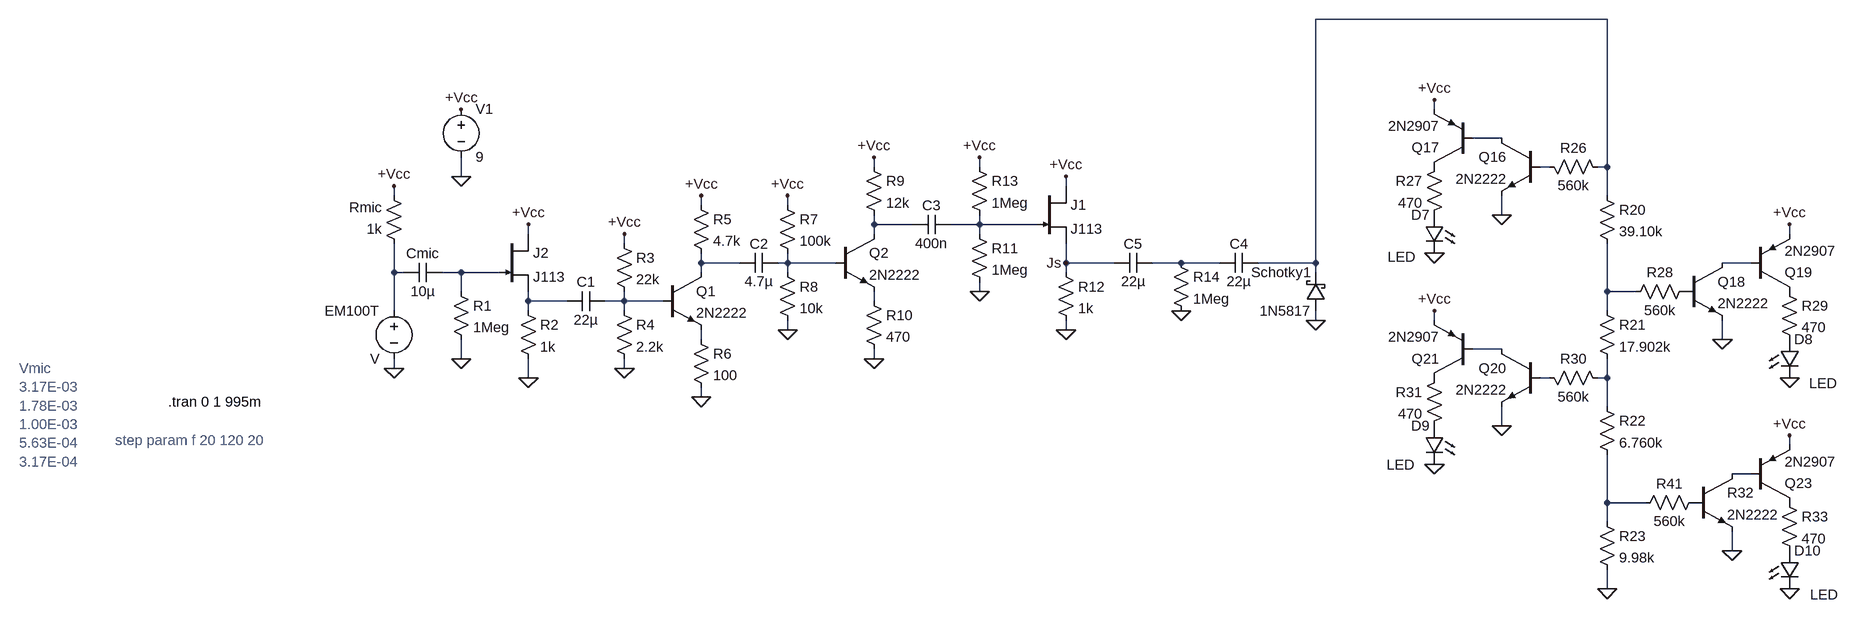
[diagram p0: schematic sound_level_meter_SPICE.asc]
sound_level_meter_SPICE.asc, the LTspice schematic file:
Version 4.1
SHEET 1 3044 2084
WIRE 1920 736 1424 736
WIRE 1632 928 1632 912
WIRE 1744 976 1696 976
WIRE 688 1024 688 1008
WIRE 864 1024 864 1008
WIRE 1824 1024 1808 1024
WIRE 1920 1024 1920 736
WIRE 1920 1024 1904 1024
WIRE 0 1040 0 1008
WIRE 1008 1056 1008 1040
WIRE -112 1072 -112 1056
WIRE 1920 1072 1920 1024
WIRE 400 1088 400 1072
WIRE 544 1088 544 1072
WIRE 1744 1104 1744 1072
WIRE 688 1120 688 1104
WIRE 752 1120 688 1120
WIRE 864 1120 864 1104
WIRE 864 1120 816 1120
WIRE 960 1120 864 1120
WIRE 112 1136 112 1120
WIRE 688 1136 688 1120
WIRE 864 1136 864 1120
WIRE 2224 1136 2224 1120
WIRE 272 1152 272 1136
WIRE 400 1184 400 1168
WIRE 464 1184 400 1184
WIRE 544 1184 544 1168
WIRE 544 1184 528 1184
WIRE 624 1184 544 1184
WIRE 1008 1184 1008 1152
WIRE 1088 1184 1008 1184
WIRE 1200 1184 1152 1184
WIRE 1264 1184 1200 1184
WIRE 1424 1184 1424 736
WIRE 1424 1184 1328 1184
WIRE 2160 1184 2112 1184
WIRE -112 1200 -112 1152
WIRE -96 1200 -112 1200
WIRE 0 1200 -32 1200
WIRE 64 1200 0 1200
WIRE 400 1200 400 1184
WIRE 544 1200 544 1184
WIRE 1008 1200 1008 1184
WIRE 1424 1200 1424 1184
WIRE 0 1232 0 1200
WIRE 864 1232 864 1216
WIRE 1920 1232 1920 1152
WIRE 1968 1232 1920 1232
WIRE 112 1248 112 1232
WIRE 176 1248 112 1248
WIRE 272 1248 272 1232
WIRE 272 1248 240 1248
WIRE 336 1248 272 1248
WIRE 688 1248 688 1232
WIRE -112 1264 -112 1200
WIRE 112 1264 112 1248
WIRE 272 1264 272 1248
WIRE 1920 1264 1920 1232
WIRE 1424 1280 1424 1264
WIRE 1632 1280 1632 1264
WIRE 544 1296 544 1280
WIRE 1008 1296 1008 1280
WIRE 400 1312 400 1296
WIRE 2112 1312 2112 1280
WIRE 1744 1328 1696 1328
WIRE 0 1344 0 1312
WIRE 688 1344 688 1328
WIRE -112 1360 -112 1344
WIRE 272 1360 272 1344
WIRE 112 1376 112 1344
WIRE 1824 1376 1808 1376
WIRE 1920 1376 1920 1344
WIRE 1920 1376 1904 1376
WIRE 400 1408 400 1392
WIRE 1920 1424 1920 1376
WIRE 1744 1456 1744 1424
WIRE 2224 1488 2224 1472
WIRE 2160 1536 2128 1536
WIRE 1920 1584 1920 1504
WIRE 1984 1584 1920 1584
WIRE 1920 1616 1920 1584
WIRE 2128 1664 2128 1632
WIRE 1920 1728 1920 1696
FLAG 0 928 +Vcc
FLAG 0 1040 0
FLAG 1920 1728 0
FLAG 1744 1104 0
FLAG 1632 912 +Vcc
FLAG 1632 1168 0
FLAG 2112 1312 0
FLAG 2224 1120 +Vcc
FLAG 2224 1376 0
FLAG 1744 1456 0
FLAG 1632 1264 +Vcc
FLAG 1632 1520 0
FLAG 2128 1664 0
FLAG 2224 1472 +Vcc
FLAG 2224 1728 0
FLAG 112 1376 0
FLAG 0 1344 0
FLAG 112 1120 +Vcc
FLAG -112 1360 0
FLAG -112 1056 +Vcc
FLAG 1424 1280 0
FLAG 272 1136 +Vcc
FLAG 400 1072 +Vcc
FLAG 272 1360 0
FLAG 400 1408 0
FLAG 544 1072 +Vcc
FLAG 688 1008 +Vcc
FLAG 544 1296 0
FLAG 688 1344 0
FLAG 1008 1040 +Vcc
FLAG 864 1232 0
FLAG 1008 1296 0
FLAG 864 1008 +Vcc
FLAG 1008 1184 Js
FLAG 1200 1264 0
SYMBOL voltage 0 912 R0
SYMATTR InstName V1
SYMATTR Value 9
SYMBOL res 1904 1056 R0
SYMATTR InstName R20
SYMATTR Value 39.10k
SYMBOL res 1904 1248 R0
SYMATTR InstName R21
SYMATTR Value 17.902k
SYMBOL res 1904 1408 R0
SYMATTR InstName R22
SYMATTR Value 6.760k
SYMBOL res 1904 1600 R0
SYMATTR InstName R23
SYMATTR Value 9.98k
SYMBOL res 1808 1008 M90
WINDOW 0 0 56 VBottom 2
WINDOW 3 32 56 VTop 2
SYMATTR InstName R26
SYMATTR Value 560k
SYMBOL npn 1808 976 M0
SYMATTR InstName Q16
SYMATTR Value 2N2222
SYMBOL pnp 1696 1024 R180
SYMATTR InstName Q17
SYMATTR Value 2N2907
SYMBOL res 1648 1008 M0
SYMATTR InstName R27
SYMATTR Value 470
SYMBOL LED 1648 1104 M0
WINDOW 3 47 70 Left 2
SYMATTR Value LED
SYMATTR InstName D7
SYMBOL res 2064 1216 R90
WINDOW 0 0 56 VBottom 2
WINDOW 3 32 56 VTop 2
SYMATTR InstName R28
SYMATTR Value 560k
SYMBOL npn 2048 1184 R0
SYMATTR InstName Q18
SYMATTR Value 2N2222
SYMBOL pnp 2160 1232 M180
SYMATTR InstName Q19
SYMATTR Value 2N2907
SYMBOL res 2208 1216 R0
SYMATTR InstName R29
SYMATTR Value 470
SYMBOL LED 2208 1312 R0
WINDOW 3 49 73 Left 2
SYMATTR Value LED
SYMATTR InstName D8
SYMBOL res 1808 1360 M90
WINDOW 0 0 56 VBottom 2
WINDOW 3 32 56 VTop 2
SYMATTR InstName R30
SYMATTR Value 560k
SYMBOL npn 1808 1328 M0
SYMATTR InstName Q20
SYMATTR Value 2N2222
SYMBOL pnp 1696 1376 R180
SYMATTR InstName Q21
SYMATTR Value 2N2907
SYMBOL res 1648 1360 M0
SYMATTR InstName R31
SYMATTR Value 470
SYMBOL LED 1648 1456 M0
WINDOW 3 49 65 Left 2
SYMATTR Value LED
SYMATTR InstName D9
SYMBOL res 2080 1568 R90
WINDOW 0 0 56 VBottom 2
WINDOW 3 32 56 VTop 2
SYMATTR InstName R41
SYMATTR Value 560k
SYMBOL npn 2064 1536 R0
SYMATTR InstName R32
SYMATTR Value 2N2222
SYMBOL pnp 2160 1584 M180
SYMATTR InstName Q23
SYMATTR Value 2N2907
SYMBOL res 2208 1568 R0
SYMATTR InstName R33
SYMATTR Value 470
SYMBOL LED 2208 1664 R0
WINDOW 3 50 74 Left 2
SYMATTR Value LED
SYMATTR InstName D10
SYMBOL njf 64 1136 R0
SYMATTR InstName J2
SYMATTR Value J113
SYMBOL res 96 1248 R0
SYMATTR InstName R2
SYMATTR Value 1k
SYMBOL res -16 1216 R0
SYMATTR InstName R1
SYMATTR Value 1Meg
SYMBOL voltage -112 1248 M0
WINDOW 123 0 0 Left 0
WINDOW 39 0 0 Left 0
SYMATTR InstName EM100T
SYMBOL res -96 1168 R180
WINDOW 0 36 76 Left 2
WINDOW 3 36 40 Left 2
SYMATTR InstName Rmic
SYMATTR Value 1k
SYMBOL cap -32 1184 R90
WINDOW 0 0 32 VBottom 2
WINDOW 3 32 32 VTop 2
SYMATTR InstName Cmic
SYMATTR Value 10µ
SYMBOL schottky 1440 1264 R180
WINDOW 0 24 64 Left 2
WINDOW 3 24 0 Left 2
SYMATTR InstName Schotky1
SYMATTR Value 1N5817
SYMBOL cap 240 1232 R90
WINDOW 0 0 32 VBottom 2
WINDOW 3 32 32 VTop 2
SYMATTR InstName C1
SYMATTR Value 22µ
SYMBOL res 256 1136 R0
SYMATTR InstName R3
SYMATTR Value 22k
SYMBOL res 256 1248 R0
SYMATTR InstName R4
SYMATTR Value 2.2k
SYMBOL res 384 1072 R0
SYMATTR InstName R5
SYMATTR Value 4.7k
SYMBOL res 384 1296 R0
SYMATTR InstName R6
SYMATTR Value 100
SYMBOL npn 336 1200 R0
SYMATTR InstName Q1
SYMATTR Value 2N2222
SYMBOL cap 528 1168 R90
WINDOW 0 0 32 VBottom 2
WINDOW 3 32 32 VTop 2
SYMATTR InstName C2
SYMATTR Value 4.7µ
SYMBOL res 528 1072 R0
SYMATTR InstName R7
SYMATTR Value 100k
SYMBOL res 528 1184 R0
SYMATTR InstName R8
SYMATTR Value 10k
SYMBOL res 672 1008 R0
SYMATTR InstName R9
SYMATTR Value 12k
SYMBOL res 672 1232 R0
SYMATTR InstName R10
SYMATTR Value 470
SYMBOL npn 624 1136 R0
SYMATTR InstName Q2
SYMATTR Value 2N2222
SYMBOL res 848 1120 R0
SYMATTR InstName R11
SYMATTR Value 1Meg
SYMBOL res 992 1184 R0
SYMATTR InstName R12
SYMATTR Value 1k
SYMBOL cap 816 1104 R90
WINDOW 0 0 32 VBottom 2
WINDOW 3 32 32 VTop 2
SYMATTR InstName C3
SYMATTR Value 400n
SYMBOL cap 1328 1168 R90
WINDOW 0 0 32 VBottom 2
WINDOW 3 32 32 VTop 2
SYMATTR InstName C4
SYMATTR Value 22µ
SYMBOL njf 960 1056 R0
SYMATTR InstName J1
SYMATTR Value J113
SYMBOL res 848 1008 R0
SYMATTR InstName R13
SYMATTR Value 1Meg
SYMBOL res 1184 1168 R0
SYMATTR InstName R14
SYMATTR Value 1Meg
SYMBOL cap 1152 1168 R90
WINDOW 0 0 32 VBottom 2
WINDOW 3 32 32 VTop 2
SYMATTR InstName C5
SYMATTR Value 22µ
TEXT -1232 1416 Left 2 !.tran 0 1 995m
TEXT -1320 1480 Left 2 ;step param f 20 120 20
TEXT -1480 1360 Left 2 ;Vmic\n3.17E-03\n1.78E-03\n1.00E-03\n5.63E-04\n3.17E-04

The netlist it stands for:
* sound_level_meter_SPICE.asc
V1 +Vcc 0 9
R20 N001 N012 39.10k
R21 N012 N019 17.902k
R22 N019 N021 6.760k
R23 N021 0 9.98k
R26 N003 N001 560k
Q16 N002 N003 0 0 2N2222
Q17 P001 N002 +Vcc 0 2N2907
R27 P001 P002 470
D7 P002 0 LED
R28 P003 N012 560k
Q18 N009 P003 0 0 2N2222
Q19 P004 N009 +Vcc 0 2N2907
R29 P004 P005 470
D8 P005 0 LED
R30 N018 N019 560k
Q20 N017 N018 0 0 2N2222
Q21 P006 N017 +Vcc 0 2N2907
R31 P006 P007 470
D9 P007 0 LED
R41 P008 N021 560k
Q§R32 N020 P008 0 0 2N2222
Q23 P009 N020 +Vcc 0 2N2907
R33 P009 P010 470
D10 P010 0 LED
J2 +Vcc N011 N013 J113
R2 N013 0 1k
R1 N011 0 1Meg
V§EM100T N010 0 V
Rmic N010 +Vcc 1k
Cmic N011 N010 10µ
D§Schotky1 0 N001 1N5817
C1 N014 N013 22µ
R3 +Vcc N014 22k
R4 N014 0 2.2k
R5 +Vcc N006 4.7k
R6 N016 0 100
Q1 N006 N014 N016 0 2N2222
C2 N007 N006 4.7µ
R7 +Vcc N007 100k
R8 N007 0 10k
R9 +Vcc N004 12k
R10 N015 0 470
Q2 N004 N007 N015 0 2N2222
R11 N005 0 1Meg
R12 Js 0 1k
C3 N005 N004 400n
C4 N001 N008 22µ
J1 +Vcc N005 Js J113
R13 +Vcc N005 1Meg
R14 N008 0 1Meg
C5 N008 Js 22µ
.model D D
.lib standard.dio
.model NPN NPN
.model PNP PNP
.lib standard.bjt
.model NJF NJF
.model PJF PJF
.lib standard.jft
.tran 0 1 995m
* step param f 20 120 20
* Vmic
* 3.17E-03
* 1.78E-03
* 1.00E-03
* 5.63E-04
* 3.17E-04
.backanno
.end